# Altium schematic sheet ADC_AK5572.SchDoc: =DocumentName
size 420 x 297 mm; CompanyName: "AS Manufacturing" LLC; Organization: "AS Manufacturing" LLC; Address1: 5 Sklyarenka St.; Address2: Kyiv 04073; Address3: Ukraine; Address4: https://ajax.systems/en/; DocumentNumber: 2; SheetNumber: 2; SheetTotal: 6; Template_version: 1.0.1
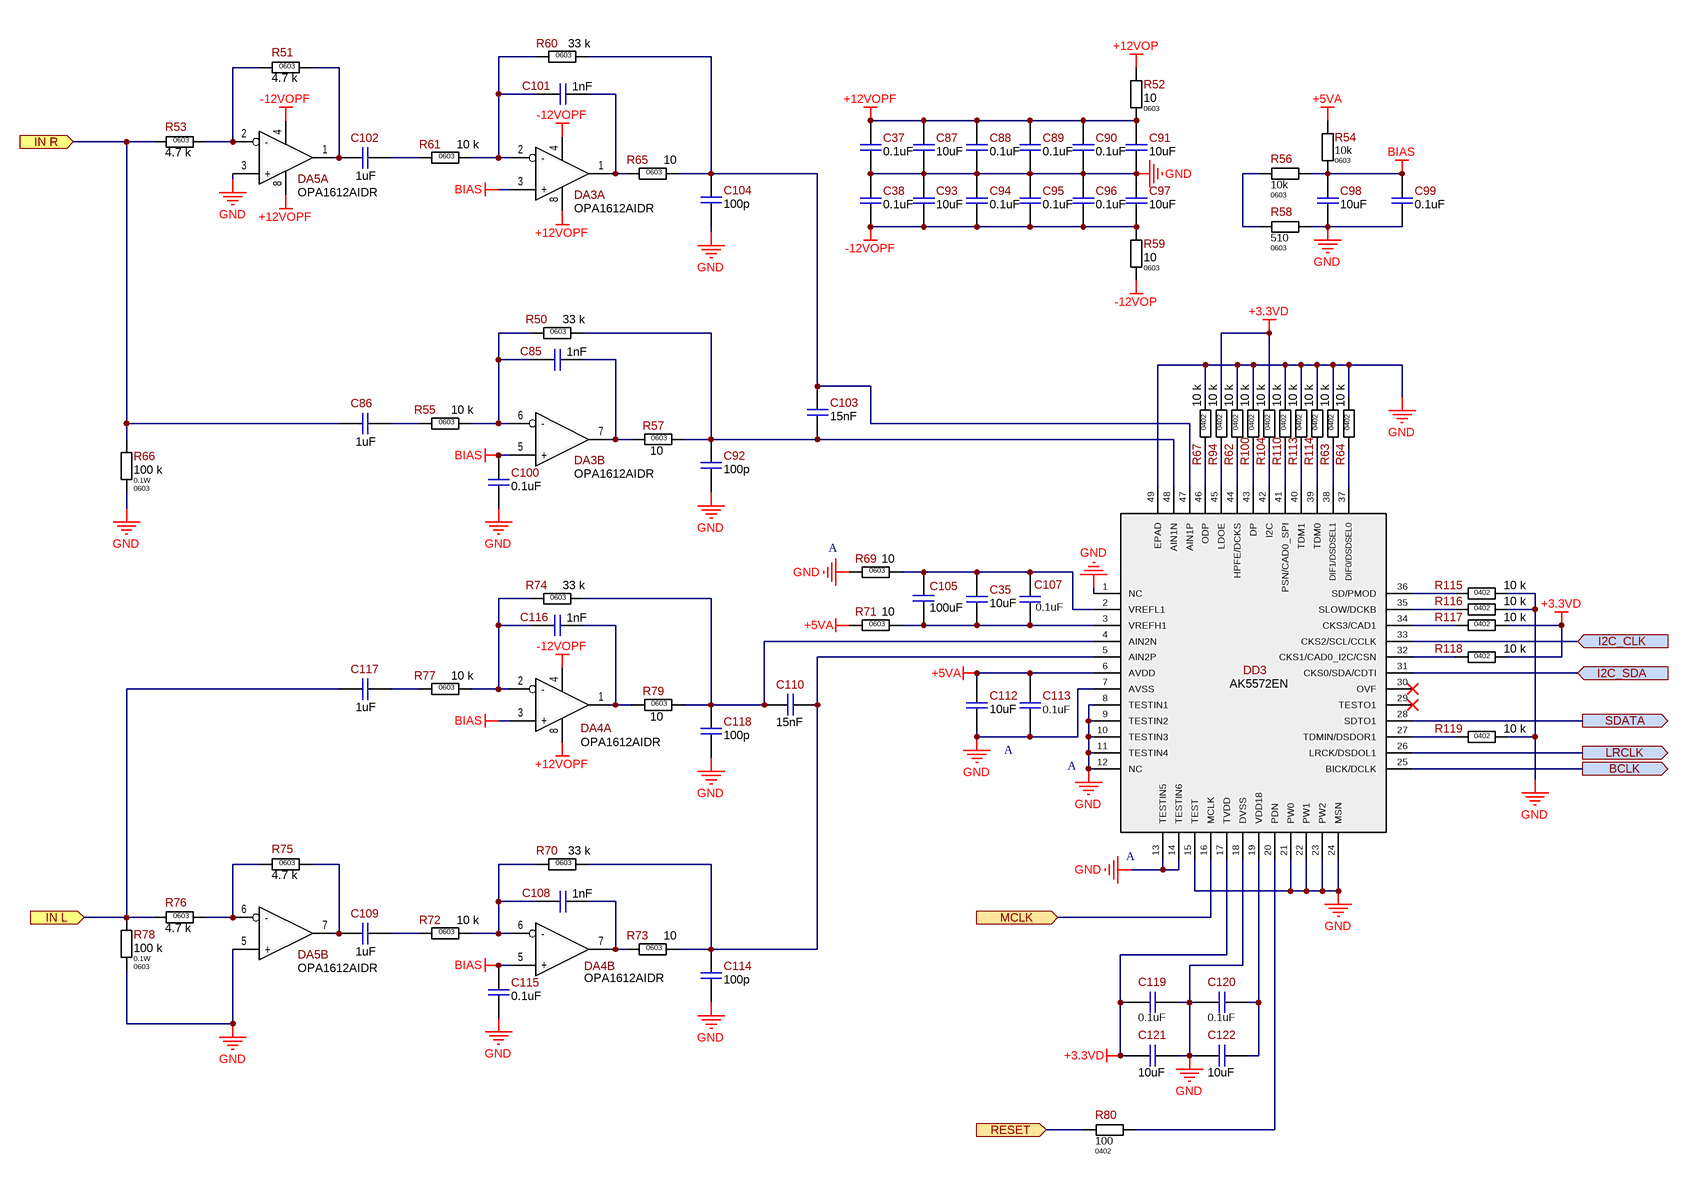
[diagram p0: ADC_AK5572.SchDoc]

## Parts
C35  10uF  [C0402(1005)]
C37  0.1uF  [C0603(1608)]
C38  0.1uF  [C0603(1608)]
C85  1nF  [C0603(1608)]
C86  1uF  [WIMA5]
C87  10uF  [C0603(1608)]
C88  0.1uF  [C0603(1608)]
C89  0.1uF  [C0603(1608)]
C90  0.1uF  [C0603(1608)]
C91  10uF  [C0603(1608)]
C92  100p  [C0603(1608)]
C93  10uF  [C0603(1608)]
C94  0.1uF  [C0603(1608)]
C95  0.1uF  [C0603(1608)]
C96  0.1uF  [C0603(1608)]
C97  10uF  [C0603(1608)]
C98  10uF  [C0603(1608)]
C99  0.1uF  [C0603(1608)]
C100  0.1uF  [C0603(1608)]
C101  1nF  [C0603(1608)]
C102  1uF  [WIMA5]
C103  15nF  [C0402(1005)]
C104  100p  [C0603(1608)]
C105  100uF  [C1206(3216)]
C107  0.1uF  [C0402(1005)]
C108  1nF  [C0603(1608)]
C109  1uF  [WIMA5]
C110  15nF  [C0402(1005)]
C112  10uF  [C0402(1005)]
C113  0.1uF  [C0402(1005)]
C114  100p  [C0603(1608)]
C115  0.1uF  [C0603(1608)]
C116  1nF  [C0603(1608)]
C117  1uF  [WIMA5]
C118  100p  [C0603(1608)]
C119  0.1uF  [C0402(1005)]
C120  0.1uF  [C0402(1005)]
C121  10uF  [C0402(1005)]
C122  10uF  [C0402(1005)]
DA3  OPA1612AIDR  [SOIC8]  (parts A,B of 2)
DA4  OPA1612AIDR  [SOIC8]  (parts A,B of 2)
DA5  OPA1612AIDR  [SOIC8]  (parts A,B of 2)
DD3  AK5572EN  [QFN50P700X700X60-49N]
R50  33 k  Package/Case: 0603  [R0603]
R51  4.7 k  Package/Case: 0603  [R0603]
R52  10  Package/Case: 0603  [R0603]
R53  4.7 k  Package/Case: 0603  [R0603]
R54  10k  Package/Case: 0603  [R0603]
R55  10 k  Package/Case: 0603  [R0603]
R56  10k  Package/Case: 0603  [R0603]
R57  10  Package/Case: 0603  [R0603]
R58  510  Package/Case: 0603  [R0603]
R59  10  Package/Case: 0603  [R0603]
R60  33 k  Package/Case: 0603  [R0603]
R61  10 k  Package/Case: 0603  [R0603]
R62  10 k  Package/Case: 0402  [R0402]
R63  10 k  Package/Case: 0402  [R0402]
R64  10 k  Package/Case: 0402  [R0402]
R65  10  Package/Case: 0603  [R0603]
R66  100 k  Power Rating: 0.1W  Package/Case: 0603  [R0603]
R67  10 k  Package/Case: 0402  [R0402]
R69  10  Package/Case: 0603  [R0603]
R70  33 k  Package/Case: 0603  [R0603]
R71  10  Package/Case: 0603  [R0603]
R72  10 k  Package/Case: 0603  [R0603]
R73  10  Package/Case: 0603  [R0603]
R74  33 k  Package/Case: 0603  [R0603]
R75  4.7 k  Package/Case: 0603  [R0603]
R76  4.7 k  Package/Case: 0603  [R0603]
R77  10 k  Package/Case: 0603  [R0603]
R78  100 k  Power Rating: 0.1W  Package/Case: 0603  [R0603]
R79  10  Package/Case: 0603  [R0603]
R80  100  Package/Case: 0402  [R0402]
R94  10 k  Package/Case: 0402  [R0402]
R100  10 k  Package/Case: 0402  [R0402]
R104  10 k  Package/Case: 0402  [R0402]
R110  10 k  Package/Case: 0402  [R0402]
R113  10 k  Package/Case: 0402  [R0402]
R114  10 k  Package/Case: 0402  [R0402]
R115  10 k  Package/Case: 0402  [R0402]
R116  10 k  Package/Case: 0402  [R0402]
R117  10 k  Package/Case: 0402  [R0402]
R118  10 k  Package/Case: 0402  [R0402]
R119  10 k  Package/Case: 0402  [R0402]

## Ports
BCLK (out), I2C_CLK (in), I2C_SDA (in), IN L (in), IN R (in), LRCLK (out), MCLK (in), RESET (in), SDATA (out)

## Nets
+3.3VD: C119.2 C121.2 DD3.17(TVDD) R94.2 R104.2 R117.1 R118.1
+5VA: C112.2 C113.2 DD3.6(AVDD) R54.1 R71.2
+12VOP: R52.1
+12VOPF: C37.2 C87.2 C88.2 C89.2 C90.2 C91.2 DA3.8(V+) DA4.8(V+) DA5.8(V+) R52.2
-12VOP: R59.2
-12VOPF: C38.1 C93.1 C94.1 C95.1 C96.1 C97.1 DA3.4(V-) DA4.4(V-) DA5.4(V-) R59.1
BIAS: C98.2 C99.2 C100.2 C115.2 DA3.3(+) DA3.5(+) DA4.3(+) DA4.5(+) R54.2 R56.2
GND: C37.1 C38.2 C87.1 C88.1 C89.1 C90.1 C91.1 C92.2 C93.2 C94.2 C95.2 C96.2 C97.2 C98.1 C99.1 C100.1 C104.2 C112.1 C113.1 C114.2 C115.1 C118.2 C119.1 C120.2 C121.1 C122.2 DA5.3(+) DA5.5(+) DD3.1(NC) DD3.7(AVSS) DD3.8(TESTIN1) DD3.9(TESTIN2) DD3.10(TESTIN3) DD3.11(TESTIN4) DD3.12(NC) DD3.13(TESTIN5) DD3.14(TESTIN6) DD3.15(TEST) DD3.18(DVSS) DD3.21(PW0) DD3.22(PW1) DD3.23(PW2) DD3.24(MSN) DD3.49(EPAD) R58.2 R62.2 R63.2 R64.2 R66.1 R67.2 R69.2 R78.1 R100.2 R110.2 R113.2 R114.2 R115.1 R116.1 R119.1
BCLK: DD3.25(BICK/DCLK) ; port BCLK
I2C_CLK: DD3.33(CKS2/SCL/CCLK) ; port I2C_CLK
I2C_SDA: DD3.31(CKS0/SDA/CDTI) ; port I2C_SDA
IN L: C117.1 R76.2 R78.2 ; port IN L
IN R: C86.1 R53.2 R66.2 ; port IN R
LRCLK: DD3.26(LRCK/DSDOL1) ; port LRCLK
MCLK: DD3.16(MCLK) ; port MCLK
RESET: R80.1 ; port RESET
SDATA: DD3.28(SDTO1) ; port SDATA
NetC35_1: C35.1 C105.2 C107.1 DD3.3(VREFH1) R71.1
NetC35_2: C35.2 C105.1 C107.2 DD3.2(VREFL1) R69.1
NetC85_1: C85.1 DA3.7(Out) R57.2
NetC85_2: C85.2 DA3.6(-) R50.2 R55.1
NetC86_2: C86.2 R55.2
NetC92_1: C92.1 C103.2 DD3.48(AIN1N) R50.1 R57.1
NetC101_1: C101.1 DA3.1(Out) R65.2
NetC101_2: C101.2 DA3.2(-) R60.2 R61.1
NetC102_1: C102.1 DA5.1(Out) R51.1
NetC102_2: C102.2 R61.2
NetC103_1: C103.1 C104.1 DD3.47(AIN1P) R60.1 R65.1
NetC108_1: C108.1 DA4.7(Out) R73.2
NetC108_2: C108.2 DA4.6(-) R70.2 R72.1
NetC109_1: C109.1 DA5.7(Out) R75.1
NetC109_2: C109.2 R72.2
NetC110_1: C110.1 C118.1 DD3.4(AIN2N) R74.1 R79.1
NetC110_2: C110.2 C114.1 DD3.5(AIN2P) R70.1 R73.1
NetC116_1: C116.1 DA4.1(Out) R79.2
NetC116_2: C116.2 DA4.2(-) R74.2 R77.1
NetC117_2: C117.2 R77.2
NetC120_1: C120.1 C122.1 DD3.19(VDD18)
NetDA5_2: DA5.2(-) R51.2 R53.1
NetDA5_6: DA5.6(-) R75.2 R76.1
NetDD3_20: DD3.20(PDN) R80.2
NetDD3_27: DD3.27(TDMIN/DSDOR1) R119.2
NetDD3_32: DD3.32(CKS1/CAD0_I2C/CSN) R118.2
NetDD3_34: DD3.34(CKS3/CAD1) R117.2
NetDD3_35: DD3.35(SLOW/DCKB) R116.2
NetDD3_36: DD3.36(SD/PMOD) R115.2
NetDD3_37: DD3.37(DIF0/DSDSEL0) R64.1
NetDD3_38: DD3.38(DIF1/DSDSEL1) R63.1
NetDD3_39: DD3.39(TDM0) R114.1
NetDD3_40: DD3.40(TDM1) R113.1
NetDD3_41: DD3.41(PSN/CAD0_SPI) R110.1
NetDD3_42: DD3.42(I2C) R104.1
NetDD3_43: DD3.43(DP) R100.1
NetDD3_44: DD3.44(HPFE/DCKS) R62.1
NetDD3_45: DD3.45(LDOE) R94.1
NetDD3_46: DD3.46(ODP) R67.1
NetR56_1: R56.1 R58.1

Not connected (* = marked no-connect by the designer): DD3 29(TESTO1)* 30(OVF)*

## Notes on the sheet
- (near R69) A
- (near DD3) PCM Mode
- A
- (near DD3) A
- 1
- 2
- 3
- 4
- 5
- 6
- 7
- 8
- B
- C
- D
- E
- F
- Назва проекту
- Мова
- UA
- Розробник
- Формат
- A3
- Версія
- Дата
- Лист
- /

## Library data of the parts
C35 C112 C121 C122 = 10uF  6.3V C0402: CAP CER 10UF 6.3V X6S 0402; Manufacturer: Murata Electronics North America; Manufacturer P/N: GRM155C80J106ME11D; Name Component: Capacitor Ceramic; Tolerance: ±20%; Operation Temperature: -55°C ~ 105°C; Library Path 1: Capacitors.SchLib; Part Number: 10uF  6.3V C0402; Value: 10uF; Temperature Coefficient: X6S; Power (V/A): 6.3V; Package/Case: C0402; Supplier 1: Digi-key; Supplier Part Number 1: 490-13233-2-ND; ComponentLink1Description: Datasheet; ComponentLink1URL: https://www.murata.com/~/media/webrenewal/support/library/catalog/products/capacitor/mlcc/c02e.ashx?la=en-us
C37 C38 C88-C90 C94-C96 C99 C100 C115 = 0.1uF  50V C0603: CAP CER 0.1UF 50V X7R 0603; Manufacturer: Samsung Electro-Mechanics; Manufacturer P/N: CL10B104KB8WPNC; Name Component: Capacitor Ceramic; Tolerance: ±10%; Operation Temperature: -55°C ~ 125°C; Library Path 1: Capacitors.SchLib; Notes: 06035C104K4T4A, 06035C104K4T2A; Part Number: 0.1uF  50V C0603; Value: 0.1uF; Temperature Coefficient: X7R; Power (V/A): 50V; Package/Case: C0603; Supplier Part Number 1: 1276-6854-2-ND; ComponentLink1Description: Datasheet; Supplier 1: Digi-key; ComponentLink1URL: https://www.samsungsem.com/resources/file/global/support/product_catalog/MLCC.pdf
C85 C101 C108 C116 = 1nF  25V C0603: CAP CER 1nF 25V X7R 0603; Manufacturer: AVX Corporation; Manufacturer P/N: 06033C102KAT2A; Name Component: Capacitor Ceramic; Tolerance: ±10%; Operation Temperature: -55°C ~ 105°C; Notes: 06033C102KAT4A, 06033C102KAJ2A; Library Path 1: Capacitors.SchLib; Part Number: 1nF  25V C0603; Value: 1nF; Temperature Coefficient: X7R; Power (V/A): 25V; Package/Case: C0603; Supplier 1: Digi-key; Supplier Part Number 1: 478-11809-2-ND; ComponentLink1Description: Datasheet; ComponentLink1URL: http://catalogs.avx.com/SurfaceMount.pdf
C86 C102 C109 C117 = 1uF  30В AC, 50В DC 5.5x10x7, 2мм: CAP FILM 1UF 10% 100VDC; Manufacturer: WIMA; Manufacturer P/N: MKS2B042201F00; Name Component: Polypropylene (PP), Metallized; Operation Temperature: -55°C ~ 125°C; Library Path 1: Capacitors.SchLib; Part Number: 1uF  30В AC, 50В DC 5.5x10x7, 2мм; Value: 1uF; Tolerance: ±10%; Power (V/A): 30В AC, 50В DC; Package/Case: 5.5x10x7, 2мм; Supplier 1: kosmodrom; ComponentLink1Description: Datasheet
C87 C91 C93 C97 C98 = 10uF  35V C0603: CAP CER 10UF 35V X5R 0603; Manufacturer: Murata Electronics North America; Manufacturer P/N: GRM188R6YA106MA73D; Name Component: Capacitor Ceramic; Tolerance: ±20%; Operation Temperature: -55°C ~ 105°C; Library Path 1: Capacitors.SchLib; Part Number: 10uF  35V C0603; Value: 10uF; Temperature Coefficient: X5R; Power (V/A): 35V; Package/Case: C0603; Supplier 1: Digi-key; Supplier Part Number 1: 490-13248-2-ND; ComponentLink1Description: Datasheet; ComponentLink1URL: https://search.murata.co.jp/Ceramy/image/img/A01X/G101/ENG/GRM188R6YA106MA73-01.pdf
C92 C104 C114 C118 = 0.1uF  50V C0603: CAP CER 0.1UF 50V X7R 0603; Manufacturer: Samsung Electro-Mechanics; Manufacturer P/N: CL10B104KB8WPNC; Name Component: Capacitor Ceramic; Tolerance: ±10%; Operation Temperature: -55°C ~ 125°C; Notes: 06035C104K4T4A, 06035C104K4T2A; Library Path 1: Capacitors.SchLib; Part Number: 0.1uF  50V C0603; Value: 0.1uF; Temperature Coefficient: X7R; Power (V/A): 50V; Package/Case: C0603; Supplier 1: Digi-key; Supplier Part Number 1: 1276-6854-2-ND; ComponentLink1Description: Datasheet; ComponentLink1URL: https://www.samsungsem.com/resources/file/global/support/product_catalog/MLCC.pdf
C103 C110 = 15nF  25V C0402: CAP CER NPO 15nF 25V; Manufacturer: Samsung Electro-Mechanics; Name Component: Capacitor Ceramic; Tolerance: 10%; Operation Temperature: -55°C ~ 85°C; Temperature Coefficient: C0G, NP0; Library Path 1: Capacitors.SchLib; Part Number: 15nF  25V C0402; Value: 15nF; Power (V/A): 25V; Package/Case: C0402; Supplier 1: Digi-key; ComponentLink1Description: Datasheet; ComponentLink1URL: https://www.samsungsem.com/resources/file/global/support/product_catalog/MLCC.pdf
C105 = 100uF  10V С1206: CAP CER 100UF 10V X5T 1206; Name Component: Capacitor Ceramic; Tolerance: ±20%; Operation Temperature: -55°C ~ 105°C; Temperature Coefficient: X5R; Library Path 1: Capacitors.SchLib; Part Number: 100uF  10V С1206; Value: 100uF; Power (V/A): 10V; Package/Case: С1206; Supplier 1: Digi-key; ComponentLink1Description: Datasheet
C107 C113 C119 C120 = 0.1uF  25V C0403: CAP CER 0.1UF 25V X7R 0603; Manufacturer: Samsung Electro-Mechanics; Name Component: Capacitor Ceramic; Tolerance: ±10%; Operation Temperature: -55°C ~ 125°C; Library Path 1: Capacitors.SchLib; Part Number: 0.1uF  25V C0403; Value: 0.1uF; Temperature Coefficient: X7R; Power (V/A): 25V; Package/Case: C0403; Supplier Part Number 1: 1276-6854-2-ND; ComponentLink1Description: Datasheet
DA3-DA5 = OPA1612AIDR: Audio Amplifier 2 Circuit Rail-to-Rail 8-SOIC; Manufacturer: Texas Instruments; Name Component: Operational amplifier; Operation Temperature: -40°C ~ 85°C; Power (V/A): 4.5V-36; Library Path 1: Integrated Circuit.SchLib; ComponentLink1URL: https://www.ti.com/general/docs/suppproductinfo.tsp?distId=10&gotoUrl=https%3A%2F%2Fwww.ti.com%2Flit%2Fgpn%2Fopa1611; ComponentLink1Description: Datasheet; Part Number: OPA1612AIDR; Value: OPA1612AIDR; Package/Case: 8-SOIC; Manufacturer P/N: OPA1612AIDR; Supplier 1: Digi-key; Supplier Part Number 1: 296-39098-6-ND
DD3 = AK5572EN: ADC, Audio 32 b 768k DSD, I2S 48-QFN (7x7); Manufacturer: Asahi Kasei Microdevices/AKM; Name Component: Audio ADC; Operation Temperature: -40°C ~ 105°C; Power (V/A): 1.8V, 5V; Library Path 1: Integrated Circuit.SchLib; Part Number: AK5572EN; Value: AK5572EN; Package/Case: 48-QFN (7x7); Manufacturer P/N: AK5572EN; Supplier 1: Digi-key; Supplier Part Number 1: 974-1116-2-ND; ComponentLink1Description: Datasheet; ComponentLink1URL: https://www.akm.com/content/dam/documents/products/audio/audio-adc/ak5572en/ak5572en-en-datasheet.pdf
R50 R60 R70 R74 = 33 k  R0603: RES SMD 33 k OHM  ±1% 1/10W 0603; Power Rating: 0.1W; Name Component: Resistror; Operation Temperature: -55℃ to 155℃; Temperature Coefficient: ±100 ppm/°C; Library Path 1: Resistor.SchLib; Part Number: 33 k  R0603; Value: 33 k; Tolerance: ±1%
R51 R53 R75 R76 = 4.7 k  R0603: RES SMD 4.7 k OHM  ±1% 1/10W 0603; Power Rating: 0.1W; Name Component: Resistror; Operation Temperature: -55℃ to 155℃; Temperature Coefficient: ±100 ppm/°C; Library Path 1: Resistor.SchLib; Part Number: 4.7 k  R0603; Value: 4.7 k; Tolerance: ±1%
R52 R57 R59 R65 R69 R71 R73 R79 = 10  R0603: RES SMD 10 OHM  ±1% 1/10W 0603; Power Rating: 0.1W; Name Component: Resistror; Operation Temperature: -55℃ to 155℃; Temperature Coefficient: ±200 ppm/°C; Library Path 1: Resistor.SchLib; Part Number: 10  R0603; Value: 10; Tolerance: ±1%
R54-R56 R61 R72 R77 = 10 k  R0603: RES SMD 10 k OHM  ±1% 1/10W 0603; Power Rating: 0.1W; Name Component: Resistror; Operation Temperature: -55℃ to 155℃; Temperature Coefficient: ±100 ppm/°C; Library Path 1: Resistor.SchLib; Part Number: 10 k  R0603; Value: 10 k; Tolerance: ±1%
R58 = 10 k  R0603: RES SMD 10 k OHM  ±1% 1/10W 0603; Power Rating: 0.1W; Name Component: Resistror; Value: 10 k; Operation Temperature: -55℃ to 155℃; Temperature Coefficient: ±100 ppm/°C; Library Path 1: Resistor.SchLib; Part Number: 10 k  R0603; Tolerance: ±1%
R62-R64 R67 R94 R100 R104 R110 R113-R119 = 10 k  R0402: RES SMD 10 k OHM  ±1% 1/16W 0402; Power Rating: 0.063W; Name Component: Resistror; Operation Temperature: -55℃ to 155℃; Temperature Coefficient: ±100 ppm/°C; Library Path 1: Resistor.SchLib; Part Number: 10 k  R0402; Value: 10 k; Tolerance: ±1%
R66 R78 = 100 k  R0603: RES SMD 100 k OHM  ±1% 1/10W 0603; Name Component: Resistror; Operation Temperature: -55℃ to 155℃; Temperature Coefficient: ±100 ppm/°C; Library Path 1: Resistor.SchLib; Part Number: 100 k  R0603; Value: 100 k; Tolerance: ±1%
R80 = 100  R0402: RES SMD 100 OHM  ±1% 1/16W 0402; Power Rating: 0.063W; Name Component: Resistror; Operation Temperature: -55℃ to 155℃; Temperature Coefficient: ±100 ppm/°C; Library Path 1: Resistor.SchLib; Part Number: 100  R0402; Value: 100; Tolerance: ±1%